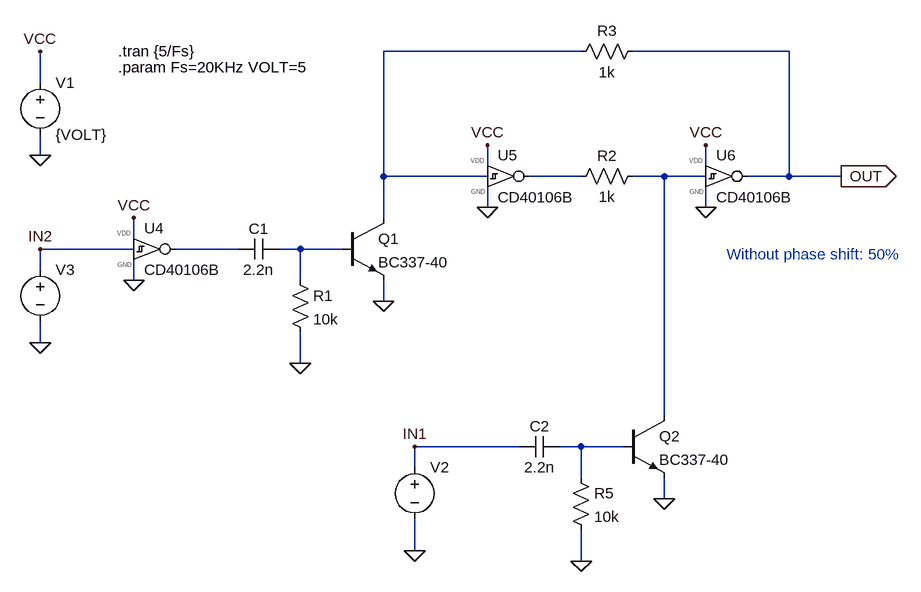
[diagram p0: schematic v1.0.asc]
v1.0.asc, the LTspice schematic file:
Version 4.1
SHEET 1 1776 852
WIRE 1072 48 768 48
WIRE 1392 48 1152 48
WIRE 240 96 240 48
WIRE 240 208 240 176
WIRE 928 224 928 192
WIRE 1264 224 1264 192
WIRE 768 240 768 48
WIRE 928 240 768 240
WIRE 1072 240 992 240
WIRE 1200 240 1152 240
WIRE 1264 240 1200 240
WIRE 1392 240 1392 48
WIRE 1392 240 1328 240
WIRE 1472 240 1392 240
WIRE 928 288 928 256
WIRE 1264 288 1264 256
WIRE 768 304 768 240
WIRE 384 336 384 304
WIRE 384 352 240 352
WIRE 544 352 448 352
WIRE 640 352 608 352
WIRE 704 352 640 352
WIRE 240 384 240 352
WIRE 384 400 384 368
WIRE 640 400 640 352
WIRE 768 432 768 400
WIRE 240 496 240 464
WIRE 640 528 640 480
WIRE 1200 608 1200 240
WIRE 976 656 816 656
WIRE 1072 656 1040 656
WIRE 1136 656 1072 656
WIRE 816 688 816 656
WIRE 1072 704 1072 656
WIRE 1200 736 1200 704
WIRE 816 816 816 768
WIRE 1072 832 1072 784
FLAG 240 208 0
FLAG 240 48 VCC
FLAG 384 400 0
FLAG 384 304 VCC
FLAG 240 496 0
FLAG 240 352 IN2
FLAG 1472 240 OUT
IOPIN 1472 240 Out
FLAG 640 528 0
FLAG 768 432 0
FLAG 928 288 0
FLAG 928 192 VCC
FLAG 1264 288 0
FLAG 1264 192 VCC
FLAG 1072 832 0
FLAG 1200 736 0
FLAG 816 816 0
FLAG 816 656 IN1
SYMBOL voltage 240 80 R0
WINDOW 123 0 0 Left 0
WINDOW 39 0 0 Left 0
SYMATTR InstName V1
SYMATTR Value {VOLT}
SYMBOL voltage 240 368 R0
WINDOW 3 41 64 Invisible 2
WINDOW 123 0 0 Left 0
WINDOW 39 0 0 Left 0
SYMATTR Value PULSE(0 {VOLT} {0.25/Fs} 1n 1n {0.5/Fs} {1/Fs})
SYMATTR InstName V3
SYMBOL cap 544 368 R270
WINDOW 0 32 32 VTop 2
WINDOW 3 0 32 VBottom 2
SYMATTR InstName C1
SYMATTR Value 2.2n
SYMBOL res 624 384 R0
SYMATTR InstName R1
SYMATTR Value 10k
SYMBOL npn 704 304 R0
SYMATTR InstName Q1
SYMATTR Value BC337-40
SYMBOL res 1056 256 R270
WINDOW 0 32 56 VTop 2
WINDOW 3 0 56 VBottom 2
SYMATTR InstName R2
SYMATTR Value 1k
SYMBOL res 1168 32 R90
WINDOW 0 0 56 VBottom 2
WINDOW 3 32 56 VTop 2
SYMATTR InstName R3
SYMATTR Value 1k
SYMBOL cap 976 672 R270
WINDOW 0 32 32 VTop 2
WINDOW 3 0 32 VBottom 2
SYMATTR InstName C2
SYMATTR Value 2.2n
SYMBOL res 1056 688 R0
SYMATTR InstName R5
SYMATTR Value 10k
SYMBOL npn 1136 608 R0
SYMATTR InstName Q2
SYMATTR Value BC337-40
SYMBOL voltage 816 672 R0
WINDOW 3 41 64 Invisible 2
WINDOW 123 0 0 Left 0
WINDOW 39 0 0 Left 0
SYMATTR Value PULSE(0 {VOLT} 0 1n 1n {0.5/Fs} {1/Fs})
SYMATTR InstName V2
SYMBOL MyLib\\Digital\\CD40106B 384 320 R0
SYMATTR InstName U4
SYMBOL MyLib\\Digital\\CD40106B 928 208 R0
SYMATTR InstName U5
SYMBOL MyLib\\Digital\\CD40106B 1264 208 R0
SYMATTR InstName U6
TEXT 360 72 Left 2 !.param Fs=20KHz VOLT=5
TEXT 360 48 Left 2 !.tran {5/Fs}
TEXT 1296 360 Left 2 ;Without phase shift: 50%

The netlist it stands for:
* v1.0.asc
V1 VCC 0 {VOLT}
V3 IN2 0 PULSE(0 {VOLT} {0.25/Fs} 1n 1n {0.5/Fs} {1/Fs})
C1 N004 N005 2.2n
R1 N005 0 10k
Q1 N001 N005 0 0 BC337-40
R2 N002 N003 1k
R3 OUT N001 1k
C2 IN1 N006 2.2n
R5 N006 0 10k
Q2 N003 N006 0 0 BC337-40
V2 IN1 0 PULSE(0 {VOLT} 0 1n 1n {0.5/Fs} {1/Fs})
X§U4 IN2 N004 VCC 0 CD40106B vdd=5 speed=2 tripdt=100n  ; pins in out VDD GND
X§U5 N001 N002 VCC 0 CD40106B vdd=5 speed=2 tripdt=100n  ; pins in out VDD GND
X§U6 N003 OUT VCC 0 CD40106B vdd=5 speed=2 tripdt=100n  ; pins in out VDD GND
.model NPN NPN
.model PNP PNP
.lib standard.bjt
.param Fs=20KHz VOLT=5
.tran {5/Fs}
* Without phase shift: 50%
.lib MyLib/Digital/_CD4xxx.lib
.backanno
.end